# Altium schematic sheet connectors-hw.SchDoc
size A3; SheetNumber: 2; SheetTotal: 3
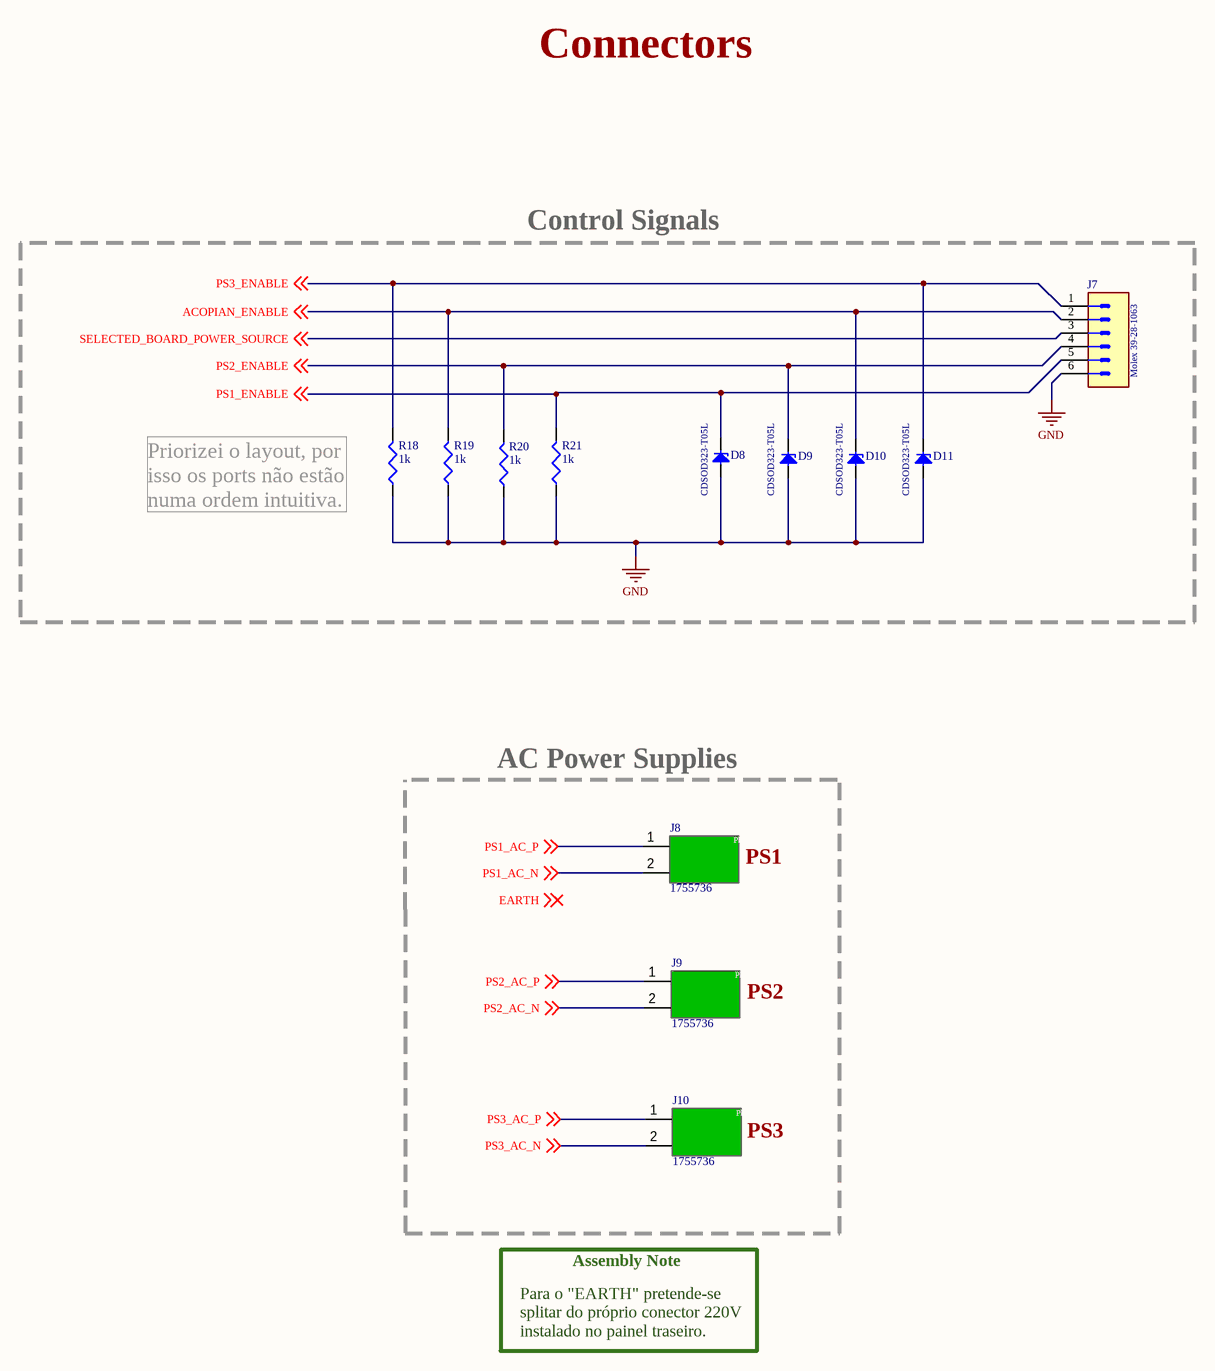
[diagram p0: connectors-hw.SchDoc]

## Parts
D8  CDSOD323-T05L  [SOD-323]
D9  CDSOD323-T05L  [SOD-323]
D10  CDSOD323-T05L  [SOD-323]
D11  CDSOD323-T05L  [SOD-323]
J7  Molex 39-28-1063  [MOLEX_39-28-1063]
J8  1755736  [Conector 2 vias]
J9  1755736  [Conector 2 vias]
J10  1755736  [Conector 2 vias]
R18  1k  [Resistor 0805]
R19  1k  [Resistor 0805]
R20  1k  [Resistor 0805]
R21  1k  [Resistor 0805]

## Blocks framed on the sheet
Control Signals: D8-D11 J7 R18-R21
AC Power Supplies: J8-J10

## Nets
GND: D8.2 D9.2 D10.2 D11.2 J7.6 R18.1 R19.1 R20.1 R21.1
ACOPIAN_ENABLE: D10.1 J7.2 R19.2 ; off-sheet ACOPIAN_ENABLE
PS1_AC_N: J8.2 ; off-sheet PS1_AC_N
PS1_AC_P: J8.1 ; off-sheet PS1_AC_P
PS1_ENABLE: D8.1 J7.5 R21.2 ; off-sheet PS1_ENABLE
PS2_AC_N: J9.2 ; off-sheet PS2_AC_N
PS2_AC_P: J9.1 ; off-sheet PS2_AC_P
PS2_ENABLE: D9.1 J7.4 R20.2 ; off-sheet PS2_ENABLE
PS3_AC_N: J10.2 ; off-sheet PS3_AC_N
PS3_AC_P: J10.1 ; off-sheet PS3_AC_P
PS3_ENABLE: D11.1 J7.1 R18.2 ; off-sheet PS3_ENABLE
SELECTED_BOARD_POWER_SOURCE: J7.3 ; off-sheet SELECTED_BOARD_POWER_SOURCE

## Notes on the sheet
- Connectors
- (near R18) Priorizei o layout, por isso os ports não estão numa ordem intuitiva.
- PS1
- PS2
- PS3
- Assembly Note
- Para o "EARTH" pretende-se splitar do próprio conector 220V instalado no painel traseiro.
- Labels drawn without touching a wire or pin: EARTH
- Title:
- Date:
- Project:
- Drawn by:
- Time:
- Revision:
- Sheet
- of
- ENT - AIS - SEI
  Sistemas Eletrônicos e
  Instrumentação
- Copyright CNPEM 2023.
  This documentation describes Open Hardware and is licensed under the CERN OHL S v2. You may redistribute and modify this documentation under the terms of the CERN OHL S v2. (https://www.ohwr.org/cernohl). This documentation is distributed WITHOUT ANY EXPRESS OR IMPLIED WARRANTY, INCLUDING OF MERCHANTABILITY, SATISFACTORY QUALITY AND FITNESS FOR A PARTICULAR PURPOSE. Please see the CERN OHL S v2 for applicable conditions.
- File:
- (in symbol Conector Phoenix 2 vias) Phoenix Contact

## Library data of the parts
D8-D11 = CDSOD323-T05L: Unidirectional TVS Diode; Supplier 1: Avnet; Supplier Part Number 1: CDSOD323-T05L
J7 = Connector 6 Male
J8-J10 = Conector Phoenix 2 vias
R18-R21 = Resistor 1k